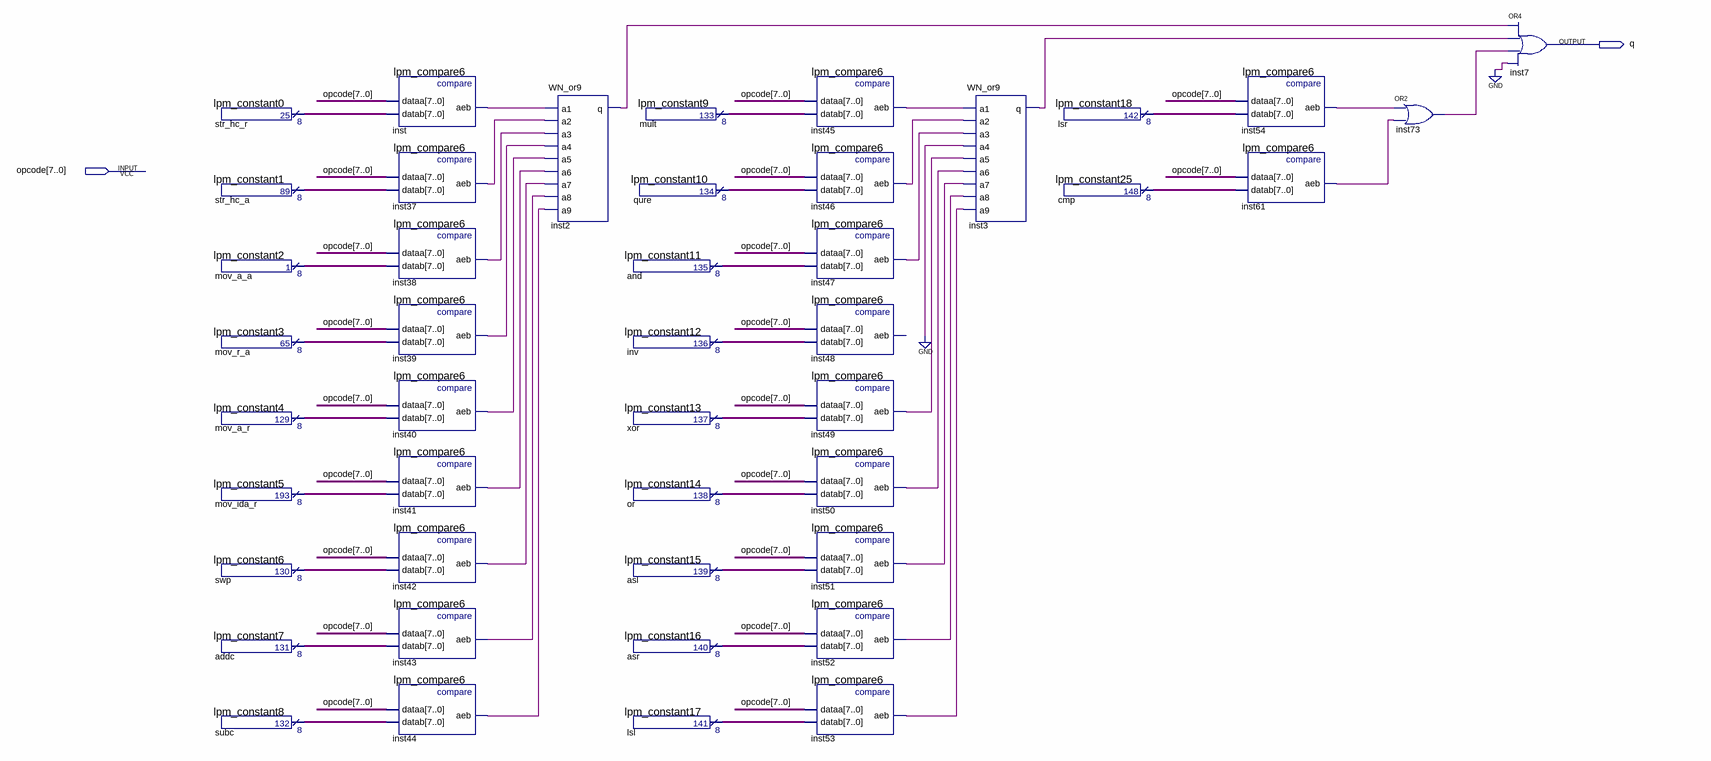
[diagram p0: schematic sheet]
// Quartus schematic WN_arity.bdf as structural Verilog: 44 symbols, 2 pins
module WN_arity (
  input  [7:0] opcode,
  output q
);

  wire inst2_q, inst3_q, inst37_aeb, inst38_aeb, inst39_aeb, inst40_aeb, inst41_aeb, inst42_aeb, inst43_aeb,
       inst44_aeb, inst45_aeb, inst46_aeb, inst47_aeb, inst49_aeb, inst50_aeb, inst51_aeb, inst52_aeb,
       inst53_aeb, inst54_aeb, inst61_aeb, inst73_out, inst_aeb;
  wire [7:0] addc_result, and_result, asl_result, asr_result, cmp_result, inv_result, lsl_result, lsr_result,
       mov_a_a_result, mov_a_r_result, mov_ida_r_result, mov_r_a_result, mult_result, or_result, qure_result,
       str_hc_a_result, str_hc_r_result, subc_result, swp_result, xor_result;

  lpm_constant0 str_hc_r (.result(str_hc_r_result));
  lpm_constant1 str_hc_a (.result(str_hc_a_result));
  lpm_constant2 mov_a_a (.result(mov_a_a_result));
  lpm_constant3 mov_r_a (.result(mov_r_a_result));
  lpm_constant4 mov_a_r (.result(mov_a_r_result));
  lpm_constant5 mov_ida_r (.result(mov_ida_r_result));
  lpm_constant6 swp (.result(swp_result));
  lpm_constant7 addc (.result(addc_result));
  lpm_constant8 subc (.result(subc_result));
  lpm_compare6 inst (.dataa(opcode), .datab(str_hc_r_result), .aeb(inst_aeb));
  lpm_compare6 inst37 (.dataa(opcode), .datab(str_hc_a_result), .aeb(inst37_aeb));
  lpm_compare6 inst38 (.dataa(opcode), .datab(mov_a_a_result), .aeb(inst38_aeb));
  lpm_compare6 inst39 (.dataa(opcode), .datab(mov_r_a_result), .aeb(inst39_aeb));
  lpm_compare6 inst40 (.dataa(opcode), .datab(mov_a_r_result), .aeb(inst40_aeb));
  lpm_compare6 inst41 (.dataa(opcode), .datab(mov_ida_r_result), .aeb(inst41_aeb));
  lpm_compare6 inst42 (.dataa(opcode), .datab(swp_result), .aeb(inst42_aeb));
  lpm_compare6 inst43 (.dataa(opcode), .datab(addc_result), .aeb(inst43_aeb));
  lpm_compare6 inst44 (.dataa(opcode), .datab(subc_result), .aeb(inst44_aeb));
  WN_or9 inst2 (
    .a1(inst_aeb), .a2(inst37_aeb), .a3(inst38_aeb), .a4(inst39_aeb), .a5(inst40_aeb), .a6(inst41_aeb),
    .a7(inst42_aeb), .a8(inst43_aeb), .a9(inst44_aeb), .q(inst2_q));
  lpm_constant9 mult (.result(mult_result));
  lpm_constant10 qure (.result(qure_result));
  lpm_constant11 \and  (.result(and_result));
  lpm_constant12 inv (.result(inv_result));
  lpm_constant13 \xor  (.result(xor_result));
  lpm_constant14 \or  (.result(or_result));
  lpm_constant15 asl (.result(asl_result));
  lpm_constant16 asr (.result(asr_result));
  lpm_constant17 lsl (.result(lsl_result));
  lpm_compare6 inst45 (.dataa(opcode), .datab(mult_result), .aeb(inst45_aeb));
  lpm_compare6 inst46 (.dataa(opcode), .datab(qure_result), .aeb(inst46_aeb));
  lpm_compare6 inst47 (.dataa(opcode), .datab(and_result), .aeb(inst47_aeb));
  lpm_compare6 inst48 (.dataa(opcode), .datab(inv_result));  // open: aeb
  lpm_compare6 inst49 (.dataa(opcode), .datab(xor_result), .aeb(inst49_aeb));
  lpm_compare6 inst50 (.dataa(opcode), .datab(or_result), .aeb(inst50_aeb));
  lpm_compare6 inst51 (.dataa(opcode), .datab(asl_result), .aeb(inst51_aeb));
  lpm_compare6 inst52 (.dataa(opcode), .datab(asr_result), .aeb(inst52_aeb));
  lpm_compare6 inst53 (.dataa(opcode), .datab(lsl_result), .aeb(inst53_aeb));
  WN_or9 inst3 (
    .a1(inst45_aeb), .a2(inst46_aeb), .a3(inst47_aeb), .a4(1'b0), .a5(inst49_aeb), .a6(inst50_aeb),
    .a7(inst51_aeb), .a8(inst52_aeb), .a9(inst53_aeb), .q(inst3_q));
  lpm_constant18 lsr (.result(lsr_result));
  lpm_constant25 cmp (.result(cmp_result));
  lpm_compare6 inst54 (.dataa(opcode), .datab(lsr_result), .aeb(inst54_aeb));
  lpm_compare6 inst61 (.dataa(opcode), .datab(cmp_result), .aeb(inst61_aeb));
  or inst73 (inst73_out, inst54_aeb, inst61_aeb);
  or inst7 (q, inst2_q, inst3_q, inst73_out, 1'b0);
endmodule
